# Altium schematic sheet 100nF SMD Ceramic 201.schdoc
size 124 x 101 mm
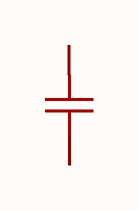
[diagram p0: 100nF SMD Ceramic 201.schdoc]

## Parts
C?  100nF  [C0201]  (value not drawn)

## Nets

Not connected (* = marked no-connect by the designer): C? 1 2

## Library data of the parts
C? = GRM033R61A104KE84D: Manufacturer: muRata(村田); Add into BOM: yes; Tolerance: ±10%; Symbol: GRM033R61A104KE84D; Device: GRM033R61A104KE84D; LCSC Part Name: 100nF ±10% 10V; Supplier Part: C161466; Manufacturer Part: GRM033R61A104KE84D; Supplier Footprint: 0201; JLCPCB Part Class: Extended Part; Datasheet: https://atta.szlcsc.com/upload/public/pdf/source/20181011/C161466_67687620A192BB2B75972275444AF1E7.pdf; Supplier: LCSC; Convert to PCB: yes; Value: 100nF